# EAGLE board 19260 (EAGLE 7.6.0)
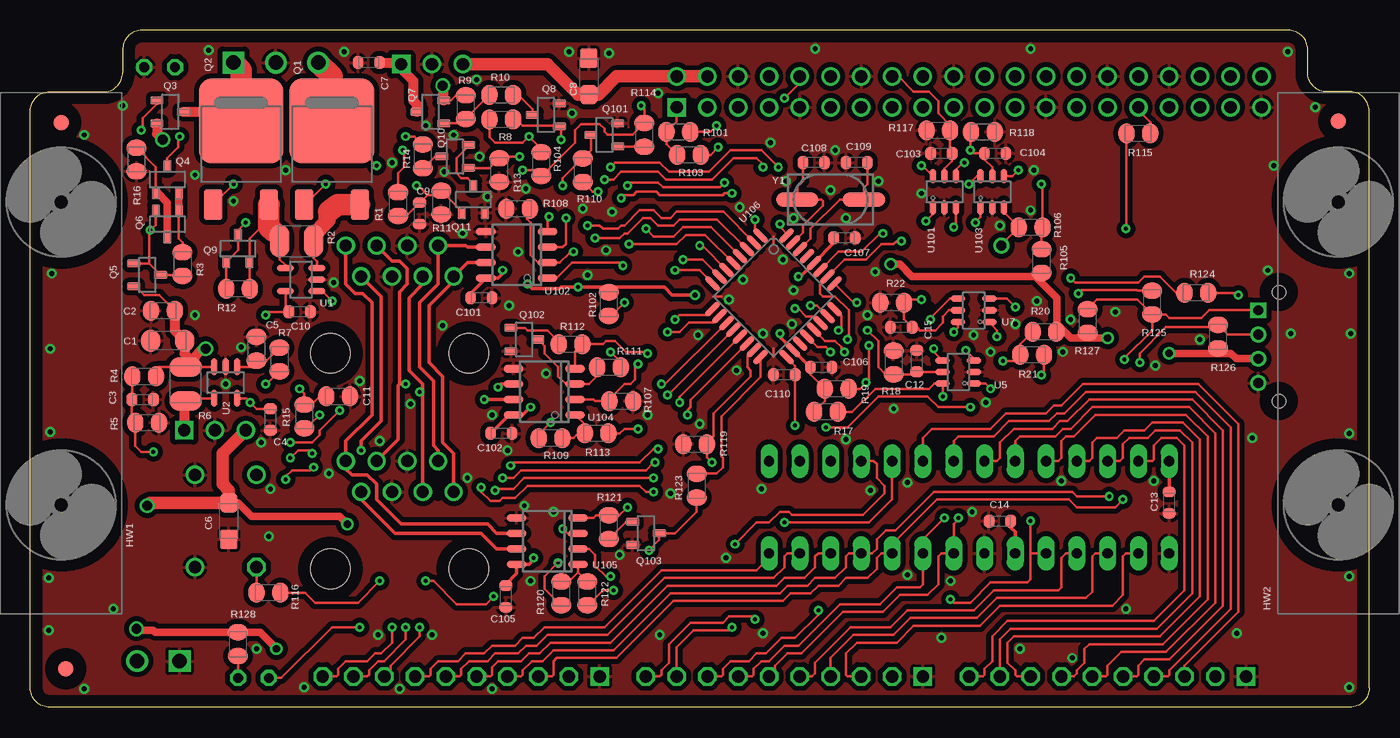
[diagram p2: board, top side]
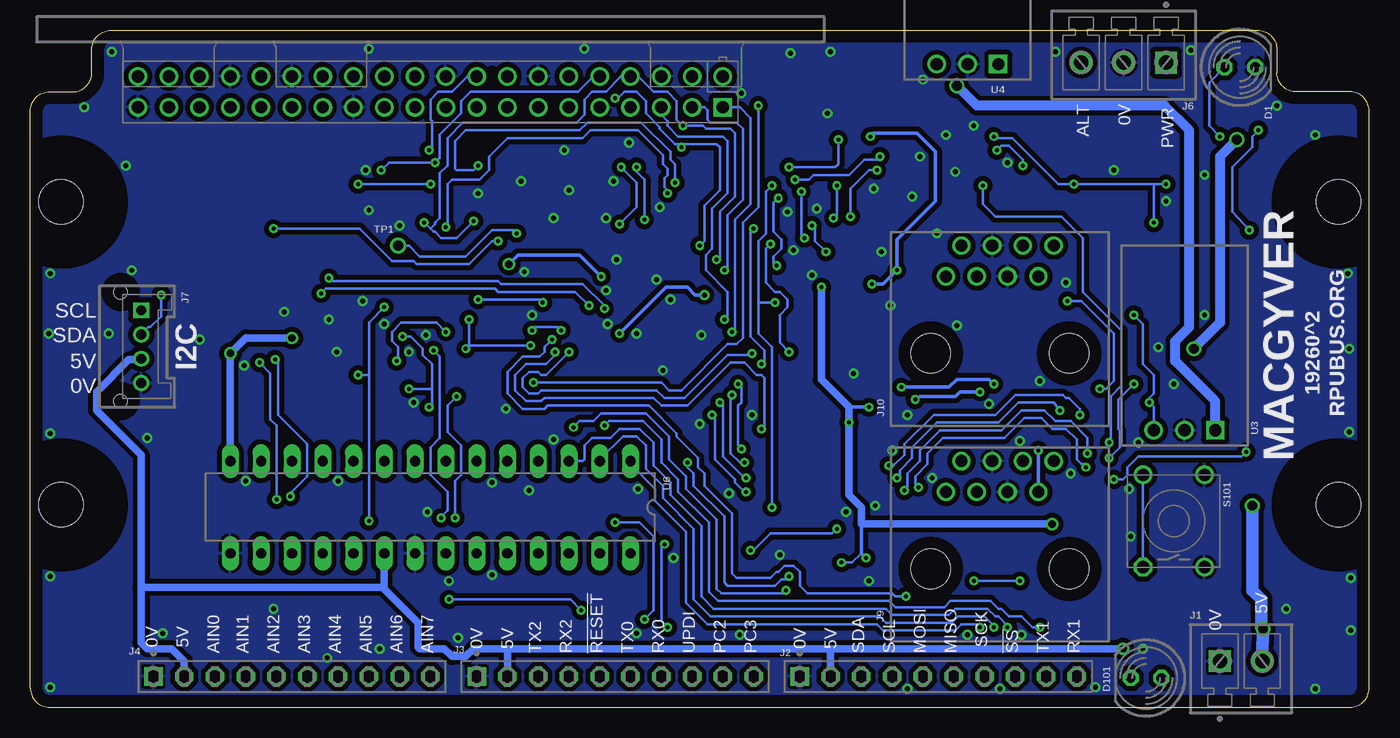
[diagram p3: board, bottom side, seen from below]

Size 110.49 x 55.88 mm. Coordinates in mm from the lower left corner, seen from the top.
Outline: 110.49,1.59 110.49,49.21 arc90 108.9,50.8 107,50.8 arc-90 105.41,52.39 105.41,54.29 arc90 103.82,55.88 9.21,55.88 arc90 7.62,54.29 7.62,52.39 arc-90 6.03,50.8 1.59,50.8 arc90 0,49.21 0,1.59 arc90 1.59,0 108.9,0 arc90 110.49,1.59
Copper layers (1*16): Top 0.034290625mm / dielectric 60mil / Bottom 0.034290625mm
Design rules "default *": minimum track width 7mil, minimum drill 13mil, track to track 12mil, track to pad 10mil, pad to pad 8mil, via to via 12mil, smd to smd 8mil, copper to edge 40mil, drill to drill 16mil, minimum pad ring 10mil, minimum via ring 8mil, stop-mask expansion 4mil, vias tented up to drill 17mil, thermal gap 10mil
Net classes: 0 default: width 0.178 mm, drill 0.33 mm
tRestrict: 7 lines
bRestrict: 1 lines

## Footprints (pad centres in the part's own frame; a part is rotated, then mirrored left to right if it is on the bottom)
C1206(3216) = smd 1.6 x 1.8: 1 -1.4,0; 2 1.4,0
C0805(2012) = smd 1.321 x 1.651: 1 -0.977,0; 2 0.977,0
C0603(1608) = smd 0.898 x 1.1: 1 -0.889,0; 2 0.889,0
3216 = smd 1.6 x 1.4: + -1.5,0; - 1.5,0
LED5MM = drill 0.813 octagon: A -1.27,0; K 1.27,0
USA10 = hole 3.658: -12.5,0; 12.5,0
MCV2 = drill 1.2 square: 1 0,0 | drill 1.2: 2 3.5,0
F1X10 = drill 1.016 square: 1 0,0 | drill 1.016 octagon: 2 2.54,0; 3 5.08,0; 4 7.62,0; 5 10.16,0; 6 12.7,0; 7 15.24,0; 8 17.78,0; 9 20.32,0; 10 22.86,0
RASPI_ZERO_V40PIN = drill 1.016 square: 1 0,2.54 | drill 1.016: 2 0,0; 3 2.54,2.54; 4 2.54,0; 5 5.08,2.54; 6 5.08,0; 7 7.62,2.54; 8 7.62,0; 9 10.16,2.54; 10 10.16,0; 11 12.7,2.54; 12 12.7,0; 13 15.24,2.54; 14 15.24,0; 15 17.78,2.54; 16 17.78,0; 17 20.32,2.54; 18 20.32,0; 19 22.86,2.54; 20 22.86,0; 21 25.4,2.54; 22 25.4,0; 23 27.94,2.54; 24 27.94,0; 25 30.48,2.54; 26 30.48,0; 27 33.02,2.54; 28 33.02,0; 29 35.56,2.54; 30 35.56,0; 31 38.1,2.54; 32 38.1,0; 33 40.64,2.54; 34 40.64,0; 35 43.18,2.54; 36 43.18,0; 37 45.72,2.54; 38 45.72,0; 39 48.26,2.54; 40 48.26,0
MCV3 = drill 1.2 square: 1 0,0 | drill 1.2: 2 3.5,0; 3 7,0
B04B = drill 0.8 square: 1 0,0 | drill 0.8: 2 2,0; 3 4,0; 4 6,0 | hole 1.1: 7.5,-1.7; -1.5,-1.7
RJ45-8HZT = drill 1: 1 -4.445,6.35; 2 -3.175,8.89; 3 -1.905,6.35; 4 -0.635,8.89; 5 0.635,6.35; 6 1.905,8.89; 7 3.175,6.35; 8 4.445,8.89 | hole 3.264: -5.715,0; 5.715,0
DPAK = smd 1.5 x 2.5: 1 -2.3,-6.9; 3 2.3,-6.9 | smd 7 x 7: SINK 0,0
SOT23 = smd 0.65 x 1.06: 1(G) -0.95,-1.1; 2(S) 0.95,-1.1; 3(D) 0,1.1
SOT23' = smd 0.65 x 1.06: B -0.95,-1.1; C 0,1.1; E 0.95,-1.1
C1210(3225) = smd 1.6 x 2.7: 1 -1.4,0; 2 1.4,0
0M311 = drill 1.016 octagon: 1 -3.81,2.54 | drill 1.016: 2 3.81,2.54; 3 -3.81,-2.54; 4 3.81,-2.54
P1-08 = drill 0.813: TP 0,0
SOT23-5 = smd 0.55 x 1.4: 1 -0.95,-1.3; 2 0,-1.3; 3 0.95,-1.3; 4 0.95,1.3; 5 -0.95,1.3
OKI-78SR-H = drill 1.016 square: 1 0,0 | drill 1.016: 2 -2.54,0; 3 -5.08,0
SOT23-6,SOT26 = smd 0.55 x 1.2: 1 -0.95,-1.3; 2 0,-1.3; 3 0.95,-1.3; 4 0.95,1.3; 5 0,1.3; 6 -0.95,1.3
DIL28-3 = drill 0.85 pad 1.422 long: 1 -16.51,-3.81; 2 -13.97,-3.81; 3 -11.43,-3.81; 4 -8.89,-3.81; 5 -6.35,-3.81; 6 -3.81,-3.81; 7 -1.27,-3.81; 8 1.27,-3.81; 9 3.81,-3.81; 10 6.35,-3.81; 11 8.89,-3.81; 12 11.43,-3.81; 13 13.97,-3.81; 14 16.51,-3.81; 15 16.51,3.81; 16 13.97,3.81; 17 11.43,3.81; 18 8.89,3.81; 19 6.35,3.81; 20 3.81,3.81; 21 1.27,3.81; 22 -1.27,3.81; 23 -3.81,3.81; 24 -6.35,3.81; 25 -8.89,3.81; 26 -11.43,3.81; 27 -13.97,3.81; 28 -16.51,3.81
SOIC8 = smd 0.6 x 1.6: 1 -1.905,-2.54; 2 -0.635,-2.54; 3 0.635,-2.54; 4 1.905,-2.54; 5 1.905,2.54; 6 0.635,2.54; 7 -0.635,2.54; 8 -1.905,2.54
TQFP32-08 = smd 1.5 x 0.45: 1 -4.293,2.8; 2 -4.293,2; 3 -4.293,1.2; 4 -4.293,0.4; 5 -4.293,-0.4; 6 -4.293,-1.2; 7 -4.293,-2; 8 -4.293,-2.8; 17 4.293,-2.8; 18 4.293,-2; 19 4.293,-1.2; 20 4.293,-0.4; 21 4.293,0.4; 22 4.293,1.2; 23 4.293,2; 24 4.293,2.8 | smd 0.45 x 1.5: 9 -2.8,-4.293; 10 -2,-4.293; 11 -1.2,-4.293; 12 -0.4,-4.293; 13 0.4,-4.293; 14 1.2,-4.293; 15 2,-4.293; 16 2.8,-4.293; 25 2.8,4.293; 26 2,4.293; 27 1.2,4.293; 28 0.4,4.293; 29 -0.4,4.293; 30 -1.2,4.293; 31 -2,4.293; 32 -2.8,4.293
FIDUCIAL-1.27 = smd 1.27 x 1.27: 1 0,0
CSM-3X = smd 3.5 x 1.2: 1 -2.75,0; 2 2.75,0

## Placement (x,y rotation side)
C1  10uF  [C1206(3216)]  11.34,30.26 180 top
C2  .1uF  [C0805(2012)]  10.94,32.74 180 top
C3  .01uF  [C0603(1608)]  9.27,25.4 0 top
C4  .1uF  [C0603(1608)]  19.81,23.75 270 top
C5  1uF  [C0805(2012)]  18.67,29.59 90 top
C6  106A  [3216]  16.38,15.37 270 top
C7  .1uF  [C0603(1608)]  27.94,53.21 180 top
C8  10uF  [3216]  46.1,52.07 90 top
C9  .01uF  [C0603(1608)]  32.13,40.77 270 top
C10  .1uF  [C0603(1608)]  22.23,32.64 0 top
C11  1uF  [C0805(2012)]  25.4,25.65 0 top
C12  .1uF  [C0603(1608)]  73.15,28.57 90 top
C13  .1uF  [C0603(1608)]  93.98,16.89 270 top
C14  .1uF  [C0603(1608)]  80.01,15.37 180 top
C15  .1uF  [C0603(1608)]  71.88,31.37 180 top
C101  .1uF  [C0603(1608)]  37.21,33.78 0 top
C102  .1uF  [C0603(1608)]  38.86,22.61 0 top
C103  .1uF  [C0603(1608)]  75.18,45.72 180 top
C104  .1uF  [C0603(1608)]  79.63,45.72 0 top
C105  .1uF  [C0603(1608)]  39.24,9.14 270 top
C106  .1uF  [C0603(1608)]  65.28,28.07 0 top
C107  .1uF  [C0603(1608)]  67.18,38.73 0 top
C108  27pF  [C0603(1608)]  64.64,44.96 180 top
C109  27pF  [C0603(1608)]  68.2,44.96 0 top
C110  .1uF  [C0603(1608)]  62.23,27.43 180 top
D1  5MMGN  [LED5MM]  10.67,52.83 0 bottom
D101  5MMRD  [LED5MM]  18.41,2.41 180 bottom
HW1  USA10-4,6  [USA10]  2.54,29.21 90 top
HW2  USA10-4,6  [USA10]  107.95,29.21 90 top
J1  PST1,0/2-3,5  [MCV2]  12.32,3.81 0 bottom
J2  PPPC101LFBN  [F1X10]  46.99,2.54 0 bottom
J3  PPPC101LFBN  [F1X10]  73.66,2.54 0 bottom
J4  PPPC101LFBN  [F1X10]  100.33,2.54 0 bottom
J5  Pi Zero  [RASPI_ZERO_V40PIN]  53.34,52.07 180 bottom
J6  PST1,0/3-3,5  [MCV3]  16.76,53.21 180 bottom
J7  S04B  [B04B]  101.35,32.77 270 bottom
J9  RJ45J  [RJ45-8HZT]  30.48,11.43 0 bottom
J10  RJ45J  [RJ45-8HZT]  30.48,29.21 0 bottom
Q1  IRFR5305  [DPAK]  24.89,48.39 0 top
Q2  IRFR5305  [DPAK]  17.4,48.39 0 top
Q3  P65  [SOT23]  11.56,49.15 270 top
Q4  K3N  [SOT23']  11.3,43.56 0 top
Q5  K1N  [SOT23']  9.65,35.69 270 top
Q6  K3N  [SOT23']  11.3,39.88 180 top
Q7  P65  [SOT23]  33.02,49.15 90 top
Q8  K38  [SOT23]  42.55,48.9 90 top
Q9  K1N  [SOT23']  17.14,37.85 0 top
Q10  K38  [SOT23]  35.05,45.47 90 top
Q11  K38  [SOT23]  36.58,41.91 0 top
Q101  K1N  [SOT23']  47.37,47.24 90 top
Q102  K1N  [SOT23']  40.77,30.35 270 top
Q103  K1N  [SOT23']  50.8,14.35 270 top
R1  100k  [C0805(2012)]  30.35,41.53 90 top
R2  0.010  [C1210(3225)]  21.97,38.48 0 top
R3  1K  [C0805(2012)]  12.57,36.58 270 top
R4  100k  [C0805(2012)]  9.4,27.3 0 top
R5  15.8k  [C0805(2012)]  9.65,23.5 180 top
R6  0.068  [C1210(3225)]  12.83,26.67 90 top
R7  10k  [C0805(2012)]  20.57,28.7 90 top
R8  10k  [C0805(2012)]  38.86,48.51 180 top
R9  100k  [C0805(2012)]  35.94,49.53 270 top
R10  80.6k  [C0805(2012)]  38.86,50.55 0 top
R11  10k  [C0805(2012)]  33.91,41.66 90 top
R12  100k  [C0805(2012)]  17.14,34.54 0 top
R13  10k  [C0805(2012)]  38.7,44.34 270 top
R14  49.9k  [C0805(2012)]  32.38,45.47 90 top
R15  10k  [C0805(2012)]  22.61,24 90 top
R16  100k  [C0805(2012)]  8.76,45.21 90 top
R17  3.01k  [C0805(2012)]  65.66,24.38 0 top
R18  10k  [C0805(2012)]  71.25,28.45 90 top
R19  3.01k  [C0805(2012)]  66.55,26.29 0 top
R20  3.01k  [C0805(2012)]  83.69,30.99 180 top
R21  3.01k  [C0805(2012)]  82.68,29.08 180 top
R22  10k  [C0805(2012)]  71.12,33.4 180 top
R101  10k  [C0805(2012)]  53.47,47.5 0 top
R102  3.01k  [C0805(2012)]  47.75,33.27 270 top
R103  1.82k  [C0805(2012)]  54.36,45.59 0 top
R104  10K  [C0805(2012)]  42.16,44.83 270 top
R105  3.01k  [C0805(2012)]  83.44,36.83 90 top
R106  3.01k  [C0805(2012)]  82.55,39.62 0 top
R107  3.01k  [C0805(2012)]  48.77,25.27 180 top
R108  3.01k  [C0805(2012)]  40.26,41.15 0 top
R109  10k  [C0805(2012)]  42.93,22.23 180 top
R110  3.01k  [C0805(2012)]  45.59,44.32 270 top
R111  3.01k  [C0805(2012)]  47.75,28.07 0 top
R112  100k  [C0805(2012)]  44.58,29.97 0 top
R113  1.82k  [C0805(2012)]  46.74,22.61 0 top
R114  100k  [C0805(2012)]  50.67,47.24 90 top
R115  100K  [C0805(2012)]  91.44,47.37 180 top
R116  1.82k  [C0805(2012)]  19.65,9.45 0 top
R117  10k  [C0805(2012)]  74.93,47.62 180 top
R118  10k  [C0805(2012)]  78.61,47.5 0 top
R119  3.01k  [C0805(2012)]  54.86,21.72 180 top
R120  10k  [C0805(2012)]  43.81,9.4 270 top
R121  100k  [C0805(2012)]  47.75,14.86 270 top
R122  182  [C0805(2012)]  45.97,9.4 90 top
R123  3.01k  [C0805(2012)]  54.99,18.29 270 top
R124  182  [C0805(2012)]  96.23,34.2 180 top
R125  182  [C0805(2012)]  92.58,33.4 90 top
R126  3.01k  [C0805(2012)]  98.01,30.59 270 top
R127  3.01k  [C0805(2012)]  87.25,31.88 270 top
R128  1.82k  [C0805(2012)]  17.14,5.21 270 top
S101  KSA0M311  [0M311]  16.13,15.37 90 bottom
TP1  TPPAD1-08  [P1-08]  80.14,38.1 0 bottom
U1  1087  [SOT23-5]  22.35,35.31 90 top
U2  1087  [SOT23-5]  16.13,26.8 180 top
U3  I50115  [OKI-78SR-H]  12.7,22.86 0 bottom
U4  I50115  [OKI-78SR-H]  30.61,53.09 0 bottom
U5  Z4  [SOT23-6,SOT26]  76.58,27.69 90 top
U6  AVR128DA28-I/SP  [DIL28-3]  77.47,16.51 180 bottom
U7  Z4  [SOT23-6,SOT26]  77.85,32.77 90 top
U101  Z4  [SOT23-6,SOT26]  75.44,42.55 0 top
U102  THVD1500  [SOIC8]  40.13,37.34 90 top
U103  Z4  [SOT23-6,SOT26]  79.38,42.55 0 top
U104  THVD1500  [SOIC8]  42.42,26.04 90 top
U105  THVD1500  [SOIC8]  42.67,13.72 90 top
U106  AVR128DB32-I/PT  [TQFP32-08]  61.33,33.92 315 top
U$1  R-PI3B+  [R-PI3B+]  77.47,50.8 0 bottom
U$2  FIDUCIAL1.27  [FIDUCIAL-1.27]  107.95,48.39 0 top
U$3  FIDUCIAL1.27  [FIDUCIAL-1.27]  2.54,48.26 0 top
U$4  FIDUCIAL1.27  [FIDUCIAL-1.27]  2.92,3.17 0 top
Y1  16MHz  [CSM-3X]  66.04,41.91 0 top

## Tracks (layer width: path | path; a pad name or v marks a point on that pad's centre or on a via)
0V  (via drill 0.41)
  Top 0.203: 61.34,28.96 61.34,29.59 | 61.34,38.23 61.34,38.86 | 56.39,33.91 57.02,33.91
  other vias: 4.45,47.24 1.78,35.81 1.65,29.59 1.65,22.73 1.52,10.67 44.45,54.1 47.75,53.98 25.91,54.1 28.83,21.97 36.83,51.82 1.52,6.35 40.26,37.59 39.5,33.15 42.55,27.56 104.01,30.86 102.11,36.07 102.62,44.7 106.05,49.53 108.84,35.81 108.97,30.86 108.84,10.79 7.62,49.66 14.73,54.23 25.02,35.05 32.64,48.01 34.92,47.24 37.72,42.16 44.7,49.02 40.89,42.8 35.69,39.12 34.04,31.5 103.76,54.1 108.84,22.61 16.13,26.67 19.05,21.84 24.64,19.3 27.18,26.92 19.68,14.1 19.81,18.03 6.86,8.13 64.77,54.36 82.55,54.36 51.82,50.67 17.4,29.72 13.59,32.38 28.7,5.97 16.76,41.78 13.59,43.94 21.08,44.32 29.84,44.96 34.16,44.2 37.08,45.47 39.37,21.21 38.1,24.13 66.04,42.67 62.36,43.43 69.98,43.43 67.31,40.39 62.1,36.96 66.42,45.97 31.37,25.02 81.66,4.83 75.18,5.71 51.94,5.97 36.07,18.92 58.29,27.81 33.15,5.97 30.48,1.52 38.1,1.52 22.61,1.65 18.67,4.83 4.45,1.52 52.83,17.65 48.64,12.57 55.12,30.73 96.52,30.35 89.53,32.64 85.09,18.67 45.97,35.69 47.5,37.72 48.01,40.89 45.59,41.15 58.55,41.27 61.09,46.61 50.93,24.13 55.24,23.37 72.39,10.92 60.45,6.1 75.95,10.41 62.99,40.39 85.85,32 83.06,33.53 81.28,31.62 79.25,29.34 77.85,30.73 78.87,25.15 69.09,32.38 69.72,35.94 62.99,34.42 62.87,31.62 71.25,24.64 72.39,18.54 69.34,17.91 60.33,18.03 67.31,22.1 57.4,12.32 90.42,8.13 85.98,4.06 108.84,1.65 99.57,6.1 100.84,22.23 92.84,28.19 85.22,29.34 92.71,18.67 77.72,16.13 82.8,44.32 82.55,41.02 80.01,39.75 73.53,42.42 60.45,30.86 57.66,33.66 58.8,35.31 40.77,16.64 43.18,16.13 41.27,10.41
  pour Bottom (isolate 0.406): 0,55.88 110.49,55.88 110.49,0 0,0
  pour Top (isolate 0.406, rank 6): 0,55.88 110.49,55.88 110.49,0 0,0
!RESET
  Top 0.203: U6.18 85.47,12.7 85.09,12.32 85.09,9.91 84.84,9.65 79.5,9.65 77.85,8 72.39,8 70.99,6.6 67.69,6.6 64.77,3.68 64.77,2.79 64.52,2.54 J3.5
!SS  (via drill 0.33)
  Top 0.203: J2.8 29.72,3.05 29.72,3.43 32.13,5.84 v32.13,6.6
  Bottom 0.203: U6.1 60.96,20.07 58.93,18.03 58.93,17.02 56.39,14.48 56.39,8.64 54.61,6.86 40.64,6.86 40.13,6.35 34.16,6.35 33.66,6.86 32.26,6.86 32.13,6.73 v32.13,6.6
+5V  (via drill 0.33, 0.41, 0.61, 0.81)
  Top 0.203: R104.1 42.16,46.1 v41.15,47.12 40.64,46.61 38.35,46.61 37.88,47.08 R8.2 | v19.43,32.38 19.68,32.64 C10.1 21.05,32.92 U1.5 | U2.5 17.81,25.5 v18.16,25.15 18.67,24.64 C4.1 | R109.2 41.95,22.52 v42.93,23.5 | R126.2 98.01,29.5 98.3,29.21 | 79.38,35.69 79.5,35.56 | R102.1 47.75,34.67 | R105.1 83.22,35.85 82.93,35.56 | C106.1 64.39,27.47 R19.1 65.57,25.27 R17.1 | R127.2 87.25,30.61 87.38,30.48 | R120.2 43.78,8.42 42.42,9.78 42.42,10.79 v43.56,11.94 | R20.1 84.67,31.33 84.84,31.5
  Top 0.305: C101.1 36.32,34.16 U102.8 38.61,35.43 38.99,35.81 v38.99,36.07 | C102.1 39.5,24.13 U104.8 40.64,24.13 v41.27,24.77 | C13.1 U6.14 | C14.1 80.9,14.86 81.28,14.48 U6.20 | v54.86,34.04 52.96,34.04 52.32,34.67 47.75,34.67 v45.21,34.67 43.81,34.67 43.69,34.54 41.4,34.54 v41.02,34.92 | v41.53,12.32 41.53,12.19 41.15,11.81 U105.8 40.13,11.05 39.24,10.16 C105.1 | v63.37,35.56 63.54,35.56 U106.28 66.29,38.31 C107.1 | 61.85,30.61 v61.85,30.86 61.85,30.57 U106.18 64.36,28.07 C106.1
  Top 0.61: v8.76,6.48 8.89,6.35 10.16,6.35 10.33,6.18 R128.1 18.96,6.18 v20.32,4.83 | v88.9,30.48 87.38,30.48 85.85,30.48 84.84,31.5 84.71,31.62 84.71,33.78 82.93,35.56 79.5,35.56 72.77,35.56 71.75,36.58 v70.99,36.58 | v93.98,29.21 98.3,29.21 99.06,29.21 99.5,28.77 J7.3 | C6.+ 17.17,16.87 18.29,15.75 25.53,15.75 v26.16,15.11
  Top 1.016: U3.3 15.88,20.95 15.88,18.41 16.38,17.91 C6.+ 9.88,16.87 v9.65,16.64
  Bottom 0.203: v19.43,32.38 18.67,31.62 18.67,28.32 17.78,27.43 17.78,25.91 18.16,25.53 v18.16,25.15 17.78,24.77 U3.3 | v43.56,11.94 42.67,11.94 41.91,12.7
  Bottom 0.305: v41.15,47.12 40.89,47.37 37.34,47.37 35.81,45.85 35.81,41.78 38.99,38.61 v38.99,36.07 40.13,34.92 v41.02,34.92 | 78.49,4.95 78.36,4.83 | v41.27,24.77 42.93,24.77 | v70.99,36.58 70.23,37.34 65.15,37.34 v63.37,35.56 | v54.86,34.04 55.63,34.04 56.26,34.67 58.04,34.67 v61.85,30.86 | 41.91,15.11 41.91,12.7 v41.53,12.32
  Bottom 0.61: J7.3 101.41,28.7 102.36,28.7 105.03,26.04 105.03,24.51 101.35,20.83 101.35,9.91 | v20.32,4.83 44.45,4.83 | 71.12,4.83 44.45,4.83 | 71.12,4.83 73.91,4.83 74.55,4.19 75.69,4.19 76.33,4.83 78.36,4.83 | 101.35,9.91 101.35,5.33 100.84,4.83 98.81,4.83 97.79,3.81 J4.2 | U6.20 81.28,9.91 | 78.49,4.95 78.49,6.99 81.28,9.78 81.28,9.91 | v45.21,34.67 45.21,27.05 42.93,24.77 v42.93,23.5 42.93,17.53 41.91,16.51 41.91,15.11 v26.16,15.11 | J2.2 44.45,4.83 | J3.2 71.12,4.83 | 81.28,9.91 101.35,9.91 | U6.14 v93.98,29.21 92.71,30.48 v88.9,30.48
  Bottom 1.016: v9.65,16.64 9.65,9.65 8.89,8.89 8.89,6.6 v8.76,6.48 8.76,5.33 8.82,5.28 J1.2
+5V_2PI
  Top 1.016: U4.3 42.67,53.09 45.19,50.57 C8.+ 46.89,50.57 48.39,52.07 | 48.39,52.07 J5.2 J5.4 | 48.36,52.07 48.39,52.07
+OOB  (via drill 0.33)
  Top 0.305: J10.6 29.84,36.83 30.48,36.83 31.11,36.2 31.11,34.92 30.48,34.29 30.48,26.67 | 30.48,26.67 30.35,26.54 30.35,22.1 J9.6 | U104.6 38.86,26.67 v38.61,26.42 | v30.99,26.67 30.48,26.67
  Bottom 0.305: v38.61,26.42 34.67,26.42 34.04,27.05 31.37,27.05 v30.99,26.67
+RX
  Top 0.305: J10.8 26.04,34.92 26.8,34.16 27.43,34.16 28.19,33.4 28.19,24.13 26.04,21.97 J9.8 26.04,19.68 26.54,19.18 27.81,19.18 28.57,18.41 28.57,17.14 30.61,15.11 37.72,15.11 38.48,14.35 U105.6
+TX
  Top 0.305: J9.2 33.66,21.21 33.27,21.59 33.27,26.92 32.13,28.07 32.13,33.4 33.66,34.92 J10.2 35.94,38.1 36.07,37.97 U102.6
-OOB  (via drill 0.33)
  Top 0.305: J10.3 32.38,34.92 31.24,33.78 31.24,27.81 32.38,26.67 32.38,26.04 | 32.38,26.04 J9.3 | U104.7 v37.47,25.4 | v32.13,26.04 32.38,26.04
  Bottom 0.305: v37.47,25.4 37.08,25.65 34.16,25.65 33.78,26.04 v32.13,26.04
-RX  (via drill 0.33)
  Top 0.305: J9.7 27.3,17.14 30.1,14.35 37.21,14.35 38.48,13.08 U105.7 | v27.3,21.21 27.3,21.97 28.96,23.62 28.96,33.91 J10.7
  Bottom 0.305: J9.7 v27.3,21.21
-TX
  Top 0.305: 35.05,35.69 J10.1 | J10.1 34.92,35.18 32.89,33.15 32.89,28.45 34.04,27.3 34.04,21.84 34.92,20.95 J9.1 | U102.7 36.07,36.7 J10.1
AIN0
  Top 0.203: J4.3 95.25,3.43 99.69,7.87 99.69,23.37 96.39,26.67 86.87,26.67 85.09,24.89 84.45,24.89 83.82,24.26 80.52,24.26 79.25,22.99 74.42,22.99 73.66,22.23 U6.6
AIN1
  Top 0.203: J4.4 93.85,2.54 93.98,2.67 93.98,3.05 99.06,8.13 99.06,23.11 96.14,26.04 87.12,26.04 85.34,24.26 84.71,24.26 84.07,23.62 80.77,23.62 79.5,22.35 76.58,22.35 76.2,21.97 U6.7
AIN2
  Top 0.203: U6.8 79.76,20.32 80.01,20.57 80.01,21.84 81.15,22.99 84.33,22.99 84.96,23.62 85.6,23.62 87.38,25.4 95.89,25.4 98.42,22.86 98.42,8.38 93.98,3.94 91.95,3.94 91.44,3.43 91.44,2.67 91.31,2.54 J4.5
AIN3
  Top 0.203: J4.6 88.77,2.54 88.9,2.67 88.9,3.43 90.04,4.57 93.73,4.57 97.79,8.64 97.79,22.61 95.63,24.77 87.63,24.77 85.85,22.99 85.22,22.99 84.58,22.35 81.66,22.35 81.28,21.97 U6.9
AIN4
  Top 0.203: J4.7 86.11,2.54 86.36,2.79 86.36,3.05 87,3.68 87,4.83 87.38,5.21 93.47,5.21 97.16,8.89 97.16,22.35 95.38,24.13 87.88,24.13 86.11,22.35 85.47,22.35 85.09,21.97 85.09,20.57 84.84,20.32 U6.10
AIN5
  Top 0.203: J4.8 81.41,2.54 81.28,2.67 81.28,3.05 80.64,3.68 80.64,5.33 81.15,5.84 93.22,5.84 96.52,9.14 96.52,22.1 95.12,23.5 92.58,23.5 91.95,22.86 90.3,22.86 89.66,22.23 88.01,22.23 87.63,21.84 87.63,20.57 87.38,20.32 U6.11
AIN6
  Top 0.203: J4.9 80.01,5.59 80.9,6.48 92.96,6.48 95.89,9.4 95.89,21.84 94.87,22.86 92.84,22.86 92.2,22.23 90.68,22.23 90.17,21.72 90.17,20.57 89.92,20.32 U6.12
AIN7
  Top 0.203: J4.10 78.61,2.54 78.74,2.67 78.74,3.17 79.38,3.81 79.38,5.84 80.64,7.11 92.71,7.11 95.25,9.65 95.25,21.59 94.61,22.23 93.34,22.23 92.71,21.59 92.71,20.45 92.58,20.32 U6.13
ALT_EN  (via drill 0.33)
  Top 0.203: v40.39,45.47 38.98,45.47 R13.1 37.9,44.52 Q10.1(G) | v47.37,43.56 48.13,43.56 48.77,44.2 51.82,44.2 52.45,43.56 56.26,43.56 58.04,45.34 59.94,45.34 60.45,44.83 v60.45,44.58 | U106.1 59.82,39.39 v59.82,40.26
  Bottom 0.203: v40.39,45.47 40.64,45.21 41.66,45.21 42.93,43.94 45.85,43.94 46.23,43.56 v47.37,43.56 | v60.45,44.58 60.45,44.2 59.82,43.56 v59.82,40.26
ALT_I  (via drill 0.33)
  Top 0.203: R15.1 23.03,23.03 23.03,23.28 v23.88,24.13 | U106.11 52.39,26.67 v52.07,26.67 | v51.82,21.34 51.44,21.34 50.29,20.19 39.88,20.19 v39.62,19.94
  Bottom 0.203: v52.07,26.67 51.82,26.42 51.82,25.15 52.07,24.89 52.07,21.59 v51.82,21.34 | v23.88,24.13 23.88,24.64 24.77,25.53 25.02,25.53 25.27,25.78 29.21,25.78 30.86,24.13 35.94,24.13 38.35,21.72 38.35,20.83 39.24,19.94 v39.62,19.94
ALT_V  (via drill 0.33)
  Top 0.203: 32.77,42.29 C9.1 31.03,40.55 R1.1 | 32.77,42.29 33.57,42.29 R11.2 35.63,40.92 Q11.1(G) | 32.77,42.29 32,43.05 v31.88,43.05 | U106.12 52.63,25.78 v52.58,25.78 | v51.56,20.19 51.44,20.19 50.8,19.56 40.51,19.56 39.88,18.92 v38.99,18.92 | v25.53,24.51 23.88,22.86 23.88,22.48 23.24,21.84 v21.46,21.84
  Bottom 0.203: v31.88,43.05 31.88,41.53 30.86,40.51 25.4,40.51 23.62,38.73 23.62,34.29 20.45,31.11 20.45,26.54 21.34,25.65 21.34,22.1 v21.46,21.84 | v52.58,25.78 52.7,25.65 52.7,20.95 51.94,20.19 v51.56,20.19 | v25.53,24.51 26.04,25.15 28.96,25.15 30.61,23.5 35.69,23.5 37.72,21.46 37.72,20.57 38.73,19.56 38.73,19.18 v38.99,18.92
APP_RX0  (via drill 0.33)
  Top 0.203: J3.7 59.56,2.54 59.69,2.67 59.69,3.17 60.33,3.81 60.96,3.81 62.23,5.08 63.37,5.08 66.8,8.51 70.1,8.51 71.5,9.91 73.41,9.91 73.66,10.16 U6.23 73.66,13.84 v75.44,15.62 | v75.31,25.65 75.31,26.71 U5.6 74.61,26.74 74.17,26.29 69.72,26.29 67.82,24.38 R17.2
  Bottom 0.203: v75.44,15.62 75.44,18.67 74.93,19.18 74.93,21.59 76.07,22.73 76.07,24.89 v75.31,25.65
APP_TX0  (via drill 0.33)
  Top 0.203: J3.6 61.47,3.05 61.47,3.43 62.48,4.45 63.63,4.45 67.06,7.87 70.36,7.87 71.75,9.27 74.04,9.27 74.93,10.16 74.93,12.45 75.18,12.7 U6.22 76.2,15.11 76.58,15.49 v76.58,15.62 | U5.3 77.88,28.8 v77.22,29.46
  Bottom 0.203: v76.58,15.62 76.58,15.75 76.07,16.26 76.07,17.78 77.47,19.18 77.47,21.46 76.71,22.23 76.71,28.96 v77.22,29.46
APP_UART_  (via drill 0.33)
  Top 0.203: U106.24 66.93,32.28 66.93,31.37 v66.67,31.11 | v69.09,31.11 69.98,30.23 69.98,28.07 70.57,27.47 R18.1 72.94,27.47 C12.1 U5.5
  Bottom 0.203: v66.67,31.11 66.93,31.37 68.83,31.37 v69.09,31.11
APP_UPDI  (via drill 0.33)
  Top 0.203: U6.19 82.55,12.7 | 82.55,12.7 82.55,10.54 82.3,10.29 79.25,10.29 77.6,8.64 76.2,8.64 v75.95,8.89 | v65.02,8 65.02,7.62 63.12,5.71 61.98,5.71 60.71,4.45 59.94,4.45 59.31,3.81 57.78,3.81 57.15,3.17 57.15,2.67 57.02,2.54 J3.8 | 82.55,12.7 v82.55,15.37 | v81.28,33.02 80.58,33.72 U7.3 | R21.1 83.65,27.65 v83.44,27.43
  Bottom 0.203: v75.95,8.89 65.91,8.89 v65.02,8 | v82.55,15.37 82.55,27.43 | 82.55,27.43 82.55,31.75 v81.28,33.02 | v83.44,27.43 82.55,27.43
APP_UPDI_  (via drill 0.33)
  Top 0.203: U106.25 67.92,33.4 v68.2,33.4 | v73.53,33.66 72.35,33.66 R22.1 72.1,32.04 C15.1 73.15,31.37 73.41,31.11 74.68,31.11 75.31,31.75 75.31,32.26 75.82,32.77 U7.5
  Bottom 0.203: v68.2,33.4 68.45,33.66 v73.53,33.66
APP_UPDI_PULLUP  (via drill 0.33)
  Top 0.203: U7.6 76.55,31.34 76.33,31.11 76.3,31.09 v76.2,30.99 | v80.26,28.57 81.19,28.57 R21.2 81.7,29.97 R20.2
  Bottom 0.203: v76.2,30.99 76.96,31.75 79.88,31.75 80.64,30.99 80.64,30.23 80.14,29.72 80.14,28.7 v80.26,28.57
FROM_RPU_OOB  (via drill 0.33)
  Top 0.203: R113.2 48.64,22.61 49.02,22.99 v50.16,22.99 | v67.18,29.34 66.93,29.59 66.93,29.72 66.42,30.23 65.59,30.23 U106.21
  Bottom 0.203: v50.16,22.99 49.91,23.24 49.91,27.18 50.16,27.43 50.55,27.43 51.56,28.45 52.7,28.45 56.26,24.89 58.42,24.89 59.05,25.53 68.07,25.53 68.33,25.27 69.6,25.27 70.48,26.16 70.48,27.43 69.6,28.32 67.94,28.32 67.18,29.08 v67.18,29.34
FROM_RPU_RX  (via drill 0.33)
  Top 0.203: v65.66,23.11 67.44,23.11 69.98,25.65 74.04,25.65 74.93,24.77 v77.6,24.77 | U5.1 78.8,26.74 v79.25,26.29 | U7.1 79.76,31.08 v79.76,30.61 | R122.1 46.01,8.42 47.24,9.65 v48.13,9.65
  Bottom 0.203: v48.13,9.65 48.39,9.4 53.47,9.4 53.85,9.78 53.85,15.49 56.39,18.03 56.39,19.05 57.78,20.45 57.78,22.35 59.69,24.26 63.37,24.26 64.01,23.62 65.15,23.62 v65.66,23.11 | v77.6,24.77 77.34,25.02 77.34,26.29 | 77.34,26.29 77.34,28.32 78.11,29.08 78.11,29.59 79.12,30.61 v79.76,30.61 | v79.25,26.29 77.34,26.29
FROM_RPU_TX  (via drill 0.33)
  Top 0.203: U102.1 43.43,35.43 44.7,36.7 48.64,36.7 v48.9,36.45 | v48.77,42.04 49.02,42.29 49.78,42.29 50.04,42.55 51.69,42.55 51.94,42.29 57.15,42.29 57.28,42.42 v57.91,42.42 | U101.3 76.39,39.82 v76.2,39.62
  Bottom 0.203: v48.9,36.45 49.15,36.7 49.15,37.21 48.51,37.85 48.51,38.61 49.15,39.24 49.15,41.66 v48.77,42.04 | v57.91,42.42 57.91,42.67 58.17,42.93 58.17,43.69 57.91,43.94 57.91,44.45 58.29,44.83 58.29,45.59 60.33,47.62 64.26,47.62 64.9,46.99 71.12,46.99 72.64,45.47 72.64,44.32 73.41,43.56 75.69,43.56 76.07,43.18 76.07,39.75 v76.2,39.62
I2C_SCL  (via drill 0.33)
  Top 0.203: J2.4 40.51,2.54 40.64,2.67 40.64,3.05 41.4,3.81 42.29,3.81 43.18,4.7 48.13,4.7 52.83,9.4 61.85,9.4 62.48,10.03 64.14,10.03 64.77,10.67 66.42,10.67 67.31,11.56 67.31,12.45 67.56,12.7 U6.25 69.47,12.7 69.85,13.08 69.85,13.84 70.61,14.61 71.37,14.61 74.55,17.78 85.98,17.78 86.36,17.4 v89.03,17.4 | v90.3,28.7 90.3,28.83 92.58,31.11 R125.1 | R125.1 93.69,32.42 93.98,32.13 96.65,32.13 97.28,32.77 J7.1 | R127.1 87.21,32.85 88.01,33.66 91.35,33.66 R125.1
  Bottom 0.203: v89.03,17.4 89.03,17.65 87.63,19.05 87.63,21.72 90.04,24.13 90.04,28.45 v90.3,28.7
I2C_SCL_  (via drill 0.33)
  Top 0.203: R125.2 91.35,34.38 91.31,34.42 86.74,34.42 v86.49,34.16 | U106.23 64.93,33.15 v64.39,33.15
  Bottom 0.203: v86.49,34.16 86.11,34.54 72.14,34.54 71.88,34.29 65.53,34.29 v64.39,33.15
I2C_SDA  (via drill 0.33)
  Top 0.203: J2.3 43.05,2.54 43.18,2.67 43.18,3.81 43.43,4.06 48.39,4.06 53.09,8.76 62.1,8.76 62.74,9.4 64.39,9.4 65.02,10.03 66.67,10.03 67.31,10.67 69.09,10.67 69.85,11.43 69.85,12.32 70.23,12.7 U6.24 71.12,13.46 74.8,17.14 85.72,17.14 86.36,16.51 89.53,16.51 v90.17,17.14 | v91.57,28.45 91.57,29.21 93.73,31.37 97.81,31.37 R126.1 98.81,30.77 J7.2 | R124.1 99.53,34.2 v99.69,34.04
  Bottom 0.203: v90.17,17.14 90.17,23.24 90.68,23.75 90.68,27.56 v91.57,28.45 | v99.69,34.04 99.69,32.26 100.58,31.37 100.74,31.37 J7.2
I2C_SDA_  (via drill 0.33)
  Top 0.203: R124.2 94.58,34.2 93.22,35.56 91.95,35.56 91.44,35.05 86.23,35.05 v85.85,35.43 | U106.22 64.69,32.26 64.01,32.26 63.37,32.89 v63.12,32.89
  Bottom 0.203: v85.85,35.43 85.6,35.18 71.88,35.18 71.63,34.92 64.9,34.92 63.12,33.15 v63.12,32.89
MGR_LED  (via drill 0.33)
  Top 0.203: D101.K 20.7,2.41 24.89,6.6 v27.18,6.6 | v63.12,23.24 C110.1 63.12,28.17 U106.17
  Bottom 0.203: v27.18,6.6 27.81,6.6 28.7,7.49 29.72,7.49 30.35,8.13 30.61,8.13 31.24,8.76 34.54,8.76 35.05,8.26 39.12,8.26 39.62,8.76 53.72,8.76 54.48,9.53 54.48,15.24 57.02,17.78 57.02,18.8 58.42,20.19 58.42,22.1 59.94,23.62 62.74,23.62 v63.12,23.24
MGR_UPDI  (via drill 0.33)
  Top 0.203: U103.3 80.33,40.87 R106.1 80.14,38.19 TP1.TP | U106.27 66.7,37.59 68.58,37.59 70.1,39.12 v70.36,39.12
  Bottom 0.203: v70.36,39.12 70.61,39.37 72.39,39.37 74.55,37.21 78.36,37.21 79.25,38.1 TP1.TP
MGR_UPDI_PULLUP  (via drill 0.33)
  Top 0.203: U103.6 78.14,43.84 v77.47,43.18 | R105.2 83.44,39.54 R106.2 83.53,42.97 v83.44,43.18
  Bottom 0.203: v77.47,43.18 v83.44,43.18
MISO
  Top 0.203: U6.27 62.48,12.7 62.23,12.45 62.23,11.56 61.34,10.67 52.32,10.67 47.62,5.97 42.67,5.97 41.78,5.08 40.89,5.08 40.26,4.45 38.35,4.45 37.72,3.81 36.2,3.81 35.56,3.17 35.56,2.67 35.43,2.54 J2.6
MOSI
  Top 0.203: U6.26 65.02,12.7 64.77,12.45 64.77,11.56 63.88,10.67 62.23,10.67 61.59,10.03 52.58,10.03 47.88,5.33 42.93,5.33 42.04,4.45 41.15,4.45 40.51,3.81 38.61,3.81 38.1,3.3 38.1,2.67 37.97,2.54 J2.5
N$2
  Top 0.203: Q7.1(G) 35.59,48.2 R9.2 35.94,48.6 R10.1
N$4
  Top 0.203: R10.2 40.26,50.55 41.45,49.36 Q8.3(D)
N$5
  Top 0.203: Q4.B 10.35,44.6 R16.2
  Top 0.61: Q6.C 11.3,41.66 10.5,42.46 Q4.B
N$6  (via drill 0.33)
  Top 0.203: 9.8,36.64 Q5.C 12.48,35.69 R3.2 | Q3.1(G) 10.46,49.83 9.27,48.64 9.27,47.75 v9.14,47.62 | Q5.B 9.8,36.64 | 9.8,36.64 9.8,39.27 v9.91,39.37 10.35,39.82 Q6.E
  Bottom 0.203: v9.91,39.37 11.3,40.89 11.3,44.58 9.65,46.23 9.65,47.12 v9.14,47.62
N$7  (via drill 0.33)
  Top 0.203: Q4.C 11.3,45.34 12.19,46.23 12.19,46.99 v12.32,47.12
  Bottom 0.203: D1.A 13.21,51.56 13.21,48.01 v12.32,47.12
N$8
  Top 0.203: U2.1 18.15,28.1 C5.1 19.51,28.61 R7.2
N$9
  Top 0.203: C108.2 63.75,43.43 63.29,42.97 Y1.1 65.28,41.91 65.41,41.78 65.41,41.4 63.75,39.75 63.75,39.17 U106.31
N$10
  Top 0.203: Q6.B 12.25,38.67 12.57,38.35 R3.1
  Top 0.61: Q4.E Q6.B
N$11
  Top 0.203: C109.2 69.09,43.18 68.79,42.88 Y1.2 66.8,41.91 64.39,39.5 64.39,38.67 U106.30
N$31  (via drill 0.33)
  Top 0.203: v28.57,44.7 Q1.SINK | R1.2 30.35,44.07 30.86,44.58 30.86,45.85 v30.73,45.97
  Top 1.778: J6.3 24.89,52.09 Q1.SINK
  Bottom 0.203: v30.73,45.97 30.35,46.35 29.72,46.35 28.57,45.21 v28.57,44.7
N$32
  Top 0.203: R12.2 18.12,36.72 Q9.E 18.09,38.67 18.92,39.5 19.56,39.5 19.68,39.62 | U1.4 21.05,36.48 20.57,36.96 R2.1
  Top 1.422: R2.1 20.57,38.74 20.07,39.24
  Top 1.778: 20.07,39.24 19.68,39.62 19.68,41.47 Q2.3
N$33  (via drill 0.33)
  Top 0.203: v30.99,47.12 31.71,47.12 R14.2 | R12.1 16.17,36.72 Q9.B 16.2,36.77 17.14,37.72 Q9.C 17.14,39.37 v17.78,40.01 | Q1.1 22.69,41.49 v24.38,43.18 | Q2.1 15.1,41.52 v16.76,43.18
  Bottom 0.203: v17.78,40.01 17.78,43.18 | 17.78,43.18 v16.76,43.18 | 17.78,43.18 v24.38,43.18 25.65,43.18 29.46,46.99 30.86,46.99 v30.99,47.12
N$34
  Top 0.203: R14.1 32.42,44.49 33.4,45.47 Q10.3(D)
N$65  (via drill 0.33)
  Top 0.203: U1.1 24.06,34.36 v24.89,33.53 | v22.23,26.29 22.61,25.91 R15.2 23.2,24.98 23.88,25.65 C11.1
  Bottom 0.203: v24.89,33.53 23.75,33.53 21.08,30.86 21.08,26.92 21.72,26.29 v22.23,26.29
N$66
  Top 0.203: U1.3 23.65,36.8 23.37,37.08 R2.2
  Top 1.27: 24.51,40.26 24.51,40.13 23.37,38.99 R2.2
  Top 1.422: 24.51,40.26 24.51,40.64 24.64,40.89
  Top 1.778: 24.64,40.89 25.36,41.49 Q1.3
N$79
  Top 0.203: Q101.B 48.5,46.27 R114.1
N$81  (via drill 0.33)
  Top 0.203: U102.3 43.94,37.97 44.2,38.23 v44.2,40.39 | Q101.C 46.27,45.98 R110.1 45.43,45.17 43.94,43.69 v43.94,43.05
  Bottom 0.203: v43.94,43.05 43.94,40.64 v44.2,40.39
N$82
  Top 0.203: R109.1 44.83,22.23 45.09,22.48 R113.1 45.76,23.33 U104.1
N$83
  Top 0.203: Q102.C 42.42,29.8 42.42,29.21 43.56,28.07 43.56,27.3 44.2,26.67 U104.3 46.1,26.67 46.86,27.43 R111.1
N$84
  Top 0.203: Q102.B 40.83,31.3 41.02,31.11 42.67,31.11 43.6,30.19 R112.1
N$85
  Top 0.203: 47.85,13.78 R121.2 49.17,15.3 Q103.B
N$86
  Top 0.203: R128.2 D101.A
N$87  (via drill 0.33)
  Top 0.203: R123.2 54.99,16.13 53.21,14.35 Q103.C 51.9,13.8 v51.05,12.95 | v43.94,14.73 44.45,14.22 U105.3
  Bottom 0.203: v51.05,12.95 50.8,12.95 49.4,14.35 44.32,14.35 v43.94,14.73
N$93
  Top 0.203: R116.1 18.68,11.55 S101.1
  Bottom 0.203: S101.2 S101.1
N$97
  Top 0.203: Q10.2(S) 36.15,46.31 35.18,45.34 35.18,44.07 35.56,43.69 36.07,43.69 36.58,43.18 Q11.3(D)
OOB_!RE  (via drill 0.33)
  Top 0.203: U104.2 46.48,25.4 46.61,25.27 R107.2 47.79,25.44 49.02,26.67 49.53,26.67 49.91,27.05 49.91,28.07 v50.16,28.32 | v50.8,39.5 51.44,38.86 53.09,38.86 53.85,39.62 56.19,39.62 U106.4
  Bottom 0.203: v50.16,28.32 49.91,28.57 49.91,29.46 51.05,30.61 51.05,39.24 v50.8,39.5
OOB_DE  (via drill 0.33)
  Top 0.203: R111.2 48.73,28.49 v47.88,29.34 | v49.4,38.23 53.34,38.23 54.1,38.99 55.7,38.99 U106.5
  Bottom 0.203: v47.88,29.34 48.64,30.1 48.64,32.38 48.01,33.02 48.01,33.66 48.64,34.29 49.02,34.29 49.78,35.05 49.78,37.85 v49.4,38.23
PC2  (via drill 0.33)
  Top 0.203: J3.9 53.34,4.95 54.74,6.35 57.66,6.35 v57.91,6.6 | U6.4 69.6,20.32 69.85,20.07 69.85,18.92 70.48,18.29 70.48,17.65 68.71,15.88 62.87,15.88 62.61,16.13 61.85,16.13 60.96,15.24 59.94,15.24 v58.17,13.46
  Bottom 0.203: v57.91,6.6 58.42,7.11 58.42,13.21 v58.17,13.46
PC3  (via drill 0.33)
  Top 0.203: J3.10 51.94,2.54 52.07,2.67 52.07,3.05 52.7,3.68 52.7,5.21 54.48,6.99 57.15,6.99 57.66,7.49 59.56,7.49 v59.82,7.24 | v62.23,15.24 69.22,15.24 71.12,17.14 U6.5
  Bottom 0.203: v59.82,7.24 59.05,8 59.05,14.1 60.2,15.24 v62.23,15.24
PI3V3  (via drill 0.33)
  Top 0.203: v52.58,30.99 53.59,30.99 54.36,31.75 56.34,31.75 U106.10 | J5.1 53.34,48.35 R101.1 52.49,46.48 R103.1
  Bottom 0.203: J5.1 51.94,49.53 51.05,48.64 51.05,41.53 52.32,40.26 52.32,31.24 v52.58,30.99
PI_RX  (via drill 0.33)
  Top 0.203: v77.09,44.96 76.96,44.96 76.39,44.38 U101.4 | U103.4 81.06,43.84 v81.53,44.32 | J5.10 63.5,51.56 v62.23,50.29 | R103.2 56.13,45.59 v56.77,46.23 | U106.6 55.5,38.05 v55.24,38.1
  Bottom 0.203: J5.10 64.01,52.07 65.28,50.8 74.17,50.8 74.93,50.04 74.93,49.02 76.71,47.24 76.71,45.34 v77.09,44.96 80.9,44.96 v81.53,44.32 | v62.23,50.29 61.98,50.29 61.47,50.8 60.45,50.8 59.69,50.04 59.69,49.02 58.55,47.88 58.55,47.75 57.28,46.48 56.77,46.48 | 56.77,46.48 53.85,46.48 53.59,46.23 53.59,42.67 54.86,41.4 54.86,38.48 v55.24,38.1 | v56.77,46.23 56.77,46.48
PI_TX  (via drill 0.33)
  Top 0.203: R101.2 56.13,47.5 v56.64,48.01 | v53.85,36.96 55.47,36.96 U106.7 | v77.98,40.01 78.42,40.45 U103.1 | U101.1 74.49,40.71 v73.91,40.13
  Bottom 0.203: v53.85,36.96 53.59,37.21 53.59,40.89 52.32,42.16 52.32,47.37 52.7,47.75 54.74,47.75 54.99,48.01 v56.64,48.01 57.15,48.51 57.15,50.04 57.91,50.8 59.05,50.8 60.33,52.07 J5.8 61.72,52.07 62.99,50.8 64.14,50.8 64.77,50.16 64.77,48.9 65.41,48.26 74.8,48.26 76.07,46.99 76.07,44.7 76.71,44.07 76.71,40.39 77.09,40.01 77.09,39.88 77.47,39.5 | v73.91,40.13 75.31,38.73 76.58,38.73 77.09,39.24 77.22,39.24 77.47,39.5 | 77.47,39.5 v77.98,40.01
PI_UART_TO_MGR_UPDI  (via drill 0.33)
  Top 0.203: R118.1 77.6,47.46 v77.6,45.97 77.85,45.72 C104.1 78.74,45.21 79.38,44.58 U103.5
  Bottom 0.203: v77.6,45.97 77.34,46.23 77.34,48.39 77.47,48.51 77.47,50.16 76.83,50.8 75.69,50.8 74.42,52.07 J5.18
PI_UART_TO_RPU
  Top 0.203: 76.2,47.92 R117.1 | R117.1 75.91,45.89 C103.1 76.07,45.09 75.44,44.45 U101.5 | R117.1 75.91,48.05 74.93,49.02 74.93,50.04 74.17,50.8 72.9,50.8 71.63,52.07 J5.16
PIPWR_EN  (via drill 0.33)
  Top 0.203: R8.1 40.13,48.51 40.64,48.01 43.58,48.01 Q8.1(G) 43.81,47.77 v43.81,46.86 | U106.32 62.48,39.03 61.85,39.66 v61.85,39.88 | v61.72,44.58 60.33,45.97 57.78,45.97 56.01,44.2 52.7,44.2 51.94,44.96 48.26,44.96 v47.88,44.58
  Bottom 0.203: v43.81,46.86 43.81,44.83 44.07,44.58 v47.88,44.58 | v61.85,39.88 60.45,41.27 60.45,43.31 v61.72,44.58
POWER
  Top 0.813: Q3.3(D) 16.64,49.15 Q2.SINK
  Top 1.778: Q2.SINK 17.4,52.58 J6.1
PWR_I  (via drill 0.33)
  Top 0.203: v19.43,26.67 19.52,26.67 R7.1 | U106.13 53.59,25.61 v53.59,25.15 | v51.44,18.92 40.77,18.92 39.88,18.03 38.48,18.03 v38.35,17.91 | v23.24,20.95 22.99,21.21 22.1,21.21 v21.46,20.57
  Bottom 0.203: v19.43,26.67 20.7,25.4 20.7,22.99 20.57,22.86 20.57,21.46 v21.46,20.57 | v53.59,25.15 53.34,24.89 53.34,20.7 51.56,18.92 v51.44,18.92 | v23.24,20.95 23.24,22.23 24.64,23.62 25.91,23.62 26.8,24.51 28.7,24.51 30.35,22.86 35.43,22.86 37.08,21.21 37.08,20.32 38.1,19.3 38.1,18.16 v38.35,17.91
PWR_V  (via drill 0.33)
  Top 0.203: v10.16,21.08 9.14,21.08 8.68,21.55 R5.2 8.38,23.79 C3.1 8.42,25.44 R4.1 | U106.14 54.48,25.37 54.48,24.77 54.23,24.51 v54.23,24.13 | v51.44,17.78 50.8,17.78 50.29,18.29 41.02,18.29 40.01,17.27 38.99,17.27 38.73,17.02 37.97,17.02 37.21,17.78 v37.21,18.16 | v21.08,18.8 21.08,19.05 21.59,19.56 23.11,19.56 v23.37,19.81
  Bottom 0.203: v54.23,24.13 53.98,23.88 53.98,20.45 52.32,18.8 52.32,18.54 51.56,17.78 v51.44,17.78 | v10.16,21.08 10.54,20.7 19.05,20.7 19.94,19.81 19.94,19.18 20.32,18.8 v21.08,18.8 | v23.37,19.81 23.62,20.07 23.75,20.07 24.13,20.45 24.13,22.1 25.02,22.99 26.16,22.99 27.05,23.88 28.45,23.88 30.1,22.23 35.18,22.23 36.45,20.95 36.45,20.07 37.47,19.05 37.47,18.41 v37.21,18.16
RX1  (via drill 0.33)
  Top 0.203: J2.10 25.27,2.54 25.4,2.67 25.4,3.17 26.04,3.81 27.81,3.81 28.45,4.45 28.96,4.45 29.84,5.33 v29.84,6.6
  Bottom 0.203: U6.3 64.9,20.32 64.77,20.45 64.77,21.59 64.14,22.23 62.61,22.23 61.85,22.99 60.2,22.99 59.05,21.84 59.05,19.94 57.66,18.54 57.66,17.53 55.12,14.99 55.12,9.14 54.1,8.13 39.88,8.13 39.37,7.62 34.67,7.62 34.16,8.13 31.5,8.13 30.86,7.49 30.61,7.49 29.84,6.73 v29.84,6.6
RX2
  Top 0.203: U6.17 87.88,12.7 87.63,12.45 87.63,9.53 87.12,9.02 79.76,9.02 78.11,7.37 72.64,7.37 71.25,5.97 67.94,5.97 66.04,4.06 J3.4
RX_!RE  (via drill 0.33)
  Top 0.203: U106.15 59.18,28.94 59.18,28.07 59.44,27.81 59.44,27.3 56.39,24.26 56.39,22.35 55.84,21.8 R119.1 55.84,20.61 v56.26,20.19 | v47.88,10.79 47.5,10.79 46.61,11.68 46.61,12.57 46.1,13.08 U105.2
  Bottom 0.203: v56.26,20.19 56.26,19.81 55.75,19.3 55.75,18.29 53.21,15.75 53.21,10.29 52.96,10.03 49.02,10.03 48.51,10.54 48.13,10.54 v47.88,10.79
RX_DE
  Top 0.203: U106.16 60.28,27.26 57.02,24 57.02,20.7 57.15,20.57 57.15,19.81 56.64,19.3 55.03,19.3 R123.1 55.59,19.39
RX_RPU
  Top 0.203: U105.1 45.21,11.14 | 45.21,11.14 R122.2 | R120.1 44.32,10.25 45.21,11.14
SCK
  Top 0.203: U6.28 60.96,12.32 59.94,11.3 52.07,11.3 47.37,6.6 42.42,6.6 41.53,5.71 40.64,5.71 40.01,5.08 38.1,5.08 37.47,4.45 35.94,4.45 35.31,3.81 33.66,3.81 33.02,3.17 33.02,2.67 32.89,2.54 J2.7
SHLD_VIN
  Top 0.813: Q7.3(D) 31.92,49.74 31.62,50.04 31.62,51.69 30.61,52.7 U4.1 30.48,53.21 C7.1
SHUTDWN  (via drill 0.33)
  Top 0.203: v32.64,10.41 33.27,10.41 35.18,8.51 37.59,8.51 v38.23,9.14 | R116.2 22.68,9.45 23.5,8.64 27.05,8.64 v28.83,10.41 | v90.42,39.5 90.46,39.54 R115.2 | v67.44,30.35 67.56,30.48 67.56,32.77 66.42,33.91 65.41,33.91 65.15,34.16 65.15,34.91 U106.26 67.2,36.96 68.96,36.96 70.23,38.23 71.25,38.23 71.5,38.48 v71.88,38.48
  Bottom 0.203: v28.83,10.41 v32.64,10.41 | v38.23,9.14 39.12,9.14 39.37,9.4 46.35,9.4 46.99,10.03 46.99,11.18 47.5,11.68 48.26,11.68 48.77,11.18 48.9,11.18 49.4,10.67 52.2,10.67 52.58,11.05 52.58,16 54.86,18.29 54.86,19.3 55.37,19.81 55.37,20.57 57.15,22.35 57.15,22.61 59.44,24.89 67.82,24.89 68.07,24.64 69.85,24.64 71.12,25.91 71.12,27.69 69.85,28.96 68.45,28.96 68.07,29.34 68.07,29.72 v67.44,30.35 | v71.88,38.48 72.39,38.48 74.3,36.58 78.61,36.58 78.87,36.83 80.64,36.83 83.31,39.5 v90.42,39.5
SHUTDWN_TO_BCM6
  Top 0.203: J5.31 91.44,49.28 92.42,48.3 R115.1
SMBUS_SCL  (via drill 0.33)
  Top 0.203: v53.21,32 53.59,32.38 55.84,32.38 U106.9
  Bottom 0.203: J5.5 58.42,48.9 57.91,48.39 57.91,48.01 57.02,47.12 53.34,47.12 52.96,46.74 52.96,42.42 54.23,41.15 54.23,37.85 54.74,37.34 54.74,36.07 52.96,34.29 52.96,32.26 v53.21,32
SMBUS_SDA  (via drill 0.33)
  Top 0.203: U106.8 55.22,36.07 v53.21,36.07
  Bottom 0.203: J5.3 54.86,49.53 54.61,49.28 54.61,48.51 54.36,48.26 52.2,48.26 51.69,47.75 51.69,41.91 52.96,40.64 52.96,36.32 v53.21,36.07
TO_RPU_OOB  (via drill 0.33)
  Top 0.203: U104.4 44.96,29.38 R112.2 47.24,29.97 47.5,30.23 48.26,30.23 49.15,29.34 50.8,29.34 v50.93,29.21 | U106.20 64.97,29.72 65.66,29.72 v66.04,29.34
  Bottom 0.203: v50.93,29.21 51.05,29.08 52.96,29.08 56.52,25.53 58.17,25.53 58.8,26.16 68.33,26.16 68.58,25.91 69.34,25.91 69.85,26.42 69.85,27.18 69.34,27.69 68.58,27.69 68.33,27.43 67.94,27.43 v66.04,29.34
TO_RPU_RX  (via drill 0.33)
  Top 0.203: v49.28,16.51 48.6,15.84 R121.1 46.7,15.84 46.48,15.62 U105.4 | v49.28,43.05 49.53,43.31 51.82,43.31 52.2,42.93 56.9,42.93 v57.28,43.31 | v73.53,44.7 73.63,44.7 U101.6 | R102.2 48.01,32.38 v49.02,33.4
  Bottom 0.203: v49.28,16.51 49.28,29.72 50.42,30.86 50.42,33.4 | 50.42,33.4 50.42,38.48 49.78,39.12 49.78,42.55 v49.28,43.05 | v73.53,44.7 73.91,44.32 75.31,44.32 75.44,44.45 75.44,46.74 74.55,47.62 65.15,47.62 64.52,48.26 60.07,48.26 57.66,45.85 57.66,45.21 57.28,44.83 v57.28,43.31 | v49.02,33.4 50.42,33.4
TO_RPU_TX  (via drill 0.33)
  Top 0.203: U102.4 42.67,40.39 v42.8,40.51 | v40.64,44.32 41.7,44.32 R104.2 42.2,43.85 44.96,46.61 44.96,47.62 45.47,48.13 46.99,48.13 47.37,47.75 47.37,47.5 47.62,47.24 49.7,47.24 R114.2 50.67,49.4 v50.42,49.66 | R19.2 68.45,26.29 v68.96,26.8 69.22,27.05 v69.22,29.84 | v74.55,29.59 74.58,29.34 U5.4 | v74.3,32 74.3,32.13 75.88,33.72 U7.4
  Bottom 0.203: v42.8,40.51 42.8,42.8 41.27,44.32 v40.64,44.32 | v50.42,49.66 50.42,41.27 51.69,40.01 51.69,30.48 52.2,29.97 52.96,29.97 56.77,26.16 57.78,26.16 58.42,26.8 v68.96,26.8 | v69.22,29.84 74.3,29.84 | 74.3,29.84 v74.55,29.59 | 74.3,29.84 v74.3,32
TX1  (via drill 0.33)
  Top 0.203: J2.9 27.81,2.54 27.94,2.67 27.94,3.05 28.7,3.81 29.21,3.81 30.99,5.59 v30.99,6.6
  Bottom 0.203: U6.2 63.5,20.45 61.59,22.35 60.45,22.35 59.69,21.59 59.69,19.68 58.29,18.29 58.29,17.27 55.75,14.73 55.75,8.89 54.36,7.49 40.39,7.49 39.88,6.99 34.42,6.99 33.91,7.49 31.75,7.49 30.99,6.73 v30.99,6.6
TX2
  Top 0.203: U6.16 90.42,12.7 90.17,12.45 90.17,9.27 89.28,8.38 80.01,8.38 78.36,6.73 72.9,6.73 71.5,5.33 68.2,5.33 67.31,4.45 67.31,2.67 67.44,2.54 J3.3
TX_!RE  (via drill 0.33)
  Top 0.203: R108.2 40.98,40.3 41.27,40.01 41.27,37.34 41.91,36.7 U102.2 43.69,36.7 44.45,37.47 44.7,37.47 v44.83,37.59 | v45.97,39.75 46.99,39.75 47.24,39.5 48.51,39.5 48.77,39.75 49.02,39.75 50.29,41.02 51.44,41.02 52.07,40.39 52.83,40.39 53.34,40.89 57.18,40.89 U106.2
  Bottom 0.203: v44.83,37.59 45.72,38.48 45.72,39.5 v45.97,39.75
TX_DE  (via drill 0.33)
  Top 0.203: v46.86,42.55 46.39,42.55 R110.2 | U106.3 56.69,40.26 53.59,40.26 53.09,39.75 51.82,39.75 51.18,40.39 50.55,40.39 49.28,39.12 49.02,39.12 48.64,38.73 v46.61,38.73
  Bottom 0.203: v46.61,38.73 46.86,38.99 v46.86,42.55
VIN  (via drill 0.81)
  Top 0.203: R9.1 35.14,50.51 34.73,50.1 Q7.2(S) | U2.4 12.93,25.5 R6.1
  Top 0.813: R6.1 12.7,25.15 U3.1 | Q7.2(S) 34.12,51.27 v34.04,51.31
  Bottom 0.813: U3.1 12.7,25.27 16,28.57 16,30.23 14.86,31.37 14.86,47.62 16.89,49.66 32.38,49.66 v34.04,51.31
VIN_S  (via drill 0.81)
  Top 0.203: 11.7,32.73 C2.1 10.62,34.04 9.4,34.04 8.7,34.74 Q5.E | U2.3 12.73,28.1 R6.2 10.58,28.07 R4.2
  Top 0.813: v14.48,29.59 14.22,29.59 13.27,28.64 | 13.27,28.64 R6.2 | 13.27,28.64 12.74,29.17 C1.1 11.92,31.08 C2.1 | Q3.2(S) 10.46,47.33 v10.92,46.86
  Bottom 0.813: v10.92,46.86 12.32,45.47 12.32,31.75 v14.48,29.59

## Text on the board
bPlace: PWR | 0V | ALT | SCL | SDA | 5V | I2C | 0V | 19260^2 | RPUBUS.ORG | MACGYVER | 5V | 0V | SCK | 5V | 0V | 5V | 0V | 5V | 0V | RX1 | TX1 | !SS | MISO | MOSI | SCL | SDA | PC3 | PC2 | UPDI | RX0 | TX0 | !RESET | RX2 | TX2 | AIN7 | AIN6 | AIN5 | AIN4 | AIN3 | AIN2 | AIN1 | AIN0